# Altium project Biricutico.PrjPCB (part 1 of 2)
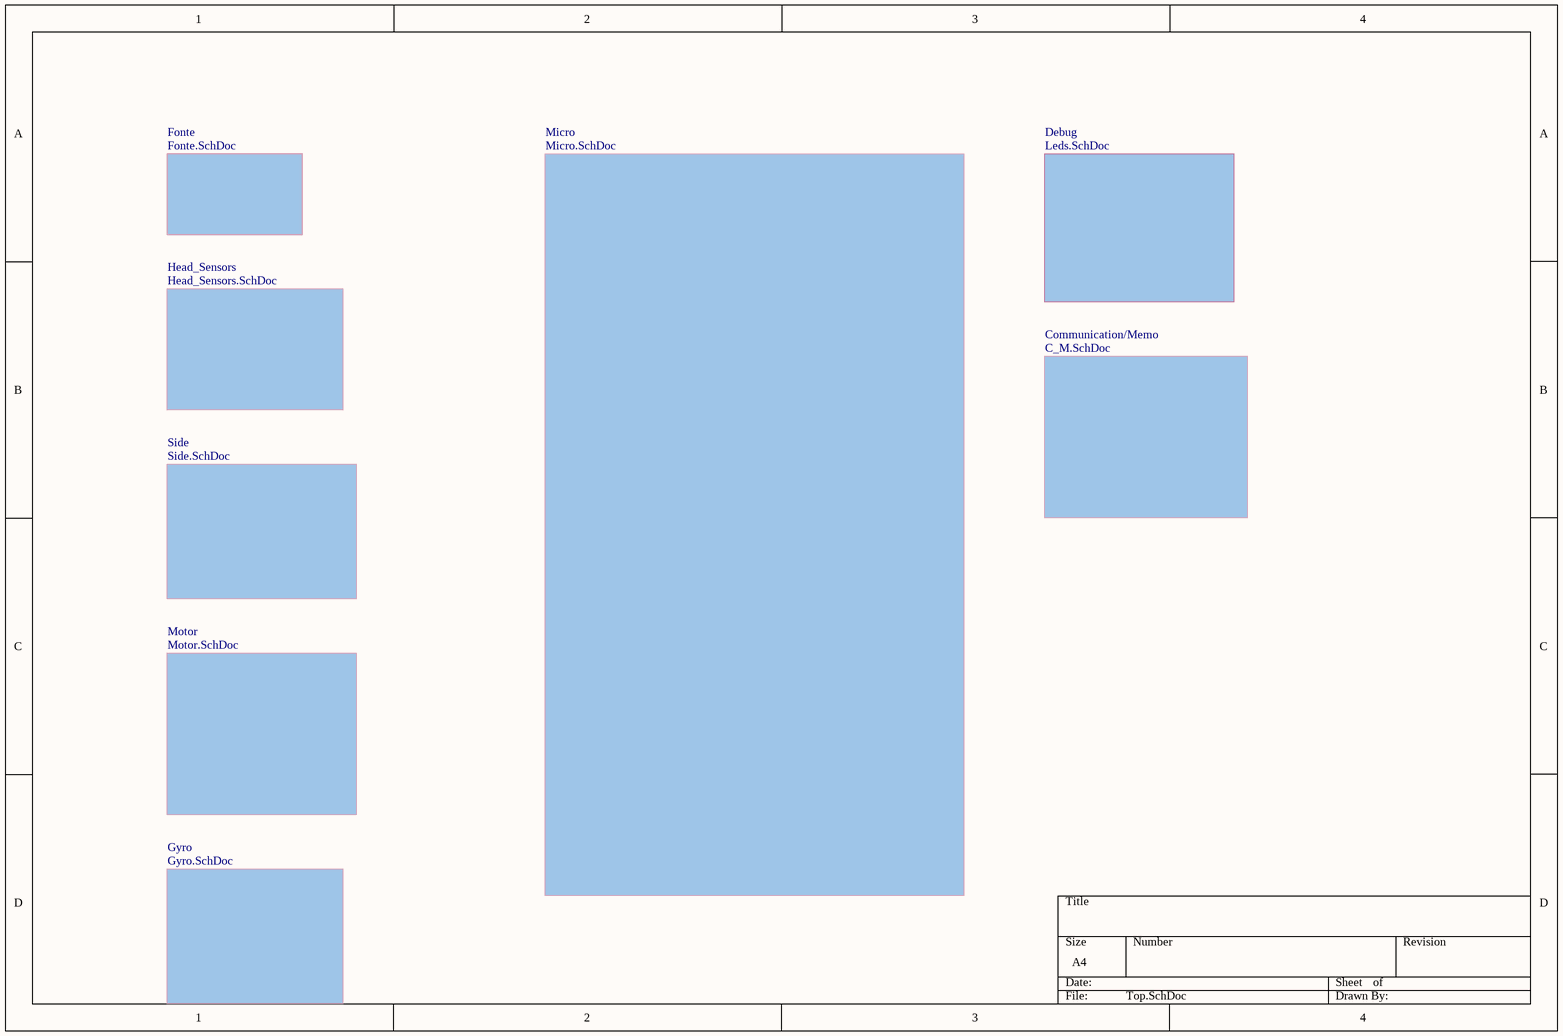
[diagram p0: Top.SchDoc]
9 sheets, 118 parts. Net scope: flat (ports and power ports of the same name join across sheets).
Board file: Biricutico.PcbDoc
Sheets:
  Top.SchDoc
    Fonte = Fonte.SchDoc
    Head_Sensors = Head_Sensors.SchDoc
    Gyro = Gyro.SchDoc
    Motor = Motor.SchDoc
    Communication/Memo = C_M.SchDoc
    Micro = Micro.SchDoc
    Side = Side.SchDoc
    Debug = Leds.SchDoc

## Sheet Top.SchDoc
size A4

### Sub-sheets
Communication/Memo = C_M.SchDoc: no entries
Debug = Leds.SchDoc: no entries
Fonte = Fonte.SchDoc: no entries
Gyro = Gyro.SchDoc: no entries
Head_Sensors = Head_Sensors.SchDoc: no entries
Micro = Micro.SchDoc: no entries
Motor = Motor.SchDoc: no entries
Side = Side.SchDoc: no entries

## Sheet Fonte.SchDoc
size A4
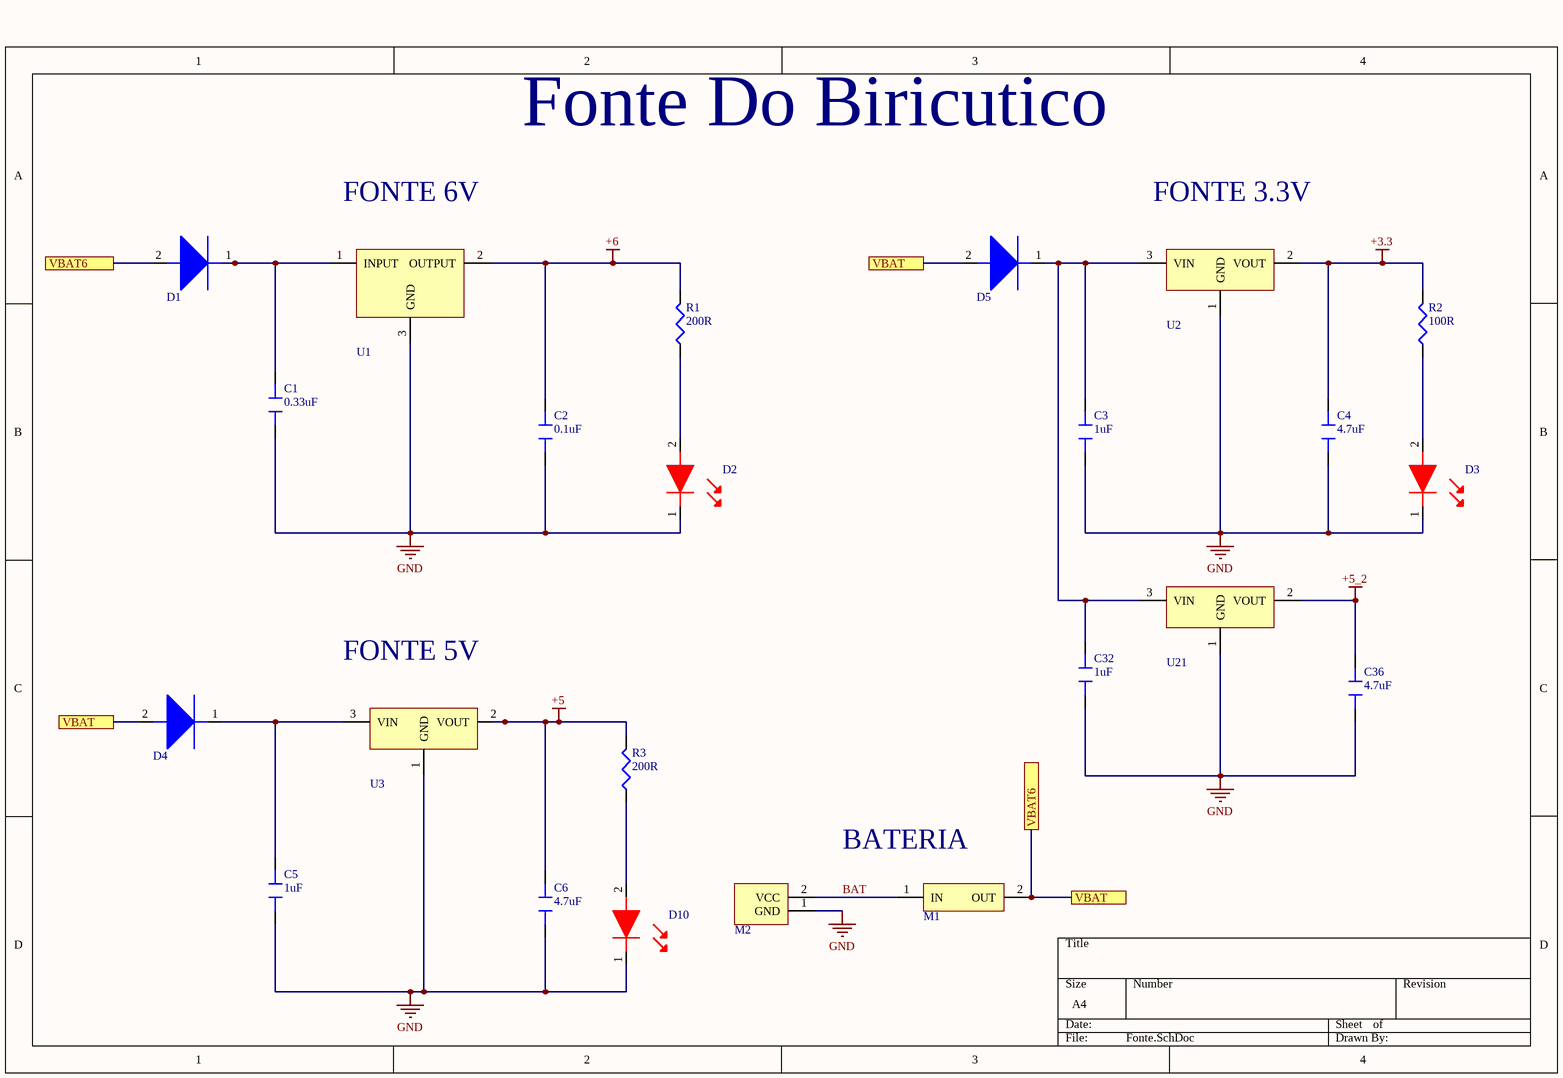
[diagram p1: Fonte.SchDoc]

### Parts
C1  0.33uF  [CAPACITOR 0805]
C2  0.1uF  [CAPACITOR 0805]
C3  1uF  [CAPACITOR 0805]
C4  4.7uF  [CAPACITOR 0805]
C5  1uF  [CAPACITOR 0805]
C6  4.7uF  [CAPACITOR 0805]
C32  1uF  [CAPACITOR 0805]
C36  4.7uF  [CAPACITOR 0805]
D1  Schottky Diode  [SODFL3516X85N]  (value not drawn)
D2  Standard LEDs - SMD  [Standard LEDs - SMD]  (value not drawn)
D3  Standard LEDs - SMD  [Standard LEDs - SMD]  (value not drawn)
D4  Schottky Diode  [SODFL3516X85N]  (value not drawn)
D5  Schottky Diode  [SODFL3516X85N]  (value not drawn)
D10  Standard LEDs - SMD  [Standard LEDs - SMD]  (value not drawn)
M1  Slide Switches  [Power_Switch]  (value not drawn)
M2  Headers (1x2)  [BATT]  (value not drawn)
R1  200R  [6-0805_M]
R2  100R  [0603]
R3  200R  [6-0805_M]
U1  Voltage Regulators 6V  [Voltage Regulators 6V]  (value not drawn)
U2  Voltage Regulators 3.3V  [SOT230P700X180-4N]  (value not drawn)
U3  Voltage Regulators 5V  [SOT230P700X180-4N]  (value not drawn)
U21  Voltage Regulators 5V  [SOT230P700X180-4N]  (value not drawn)

### Ports
VBAT, VBAT6

### Nets
+3.3: C4.2 R2.2 U2.2(VOUT)
+5: C6.2 R3.2 U3.2(VOUT)
+5_2: C36.2 U21.2(VOUT)
+6: C2.1 R1.2 U1.2(OUTPUT)
GND: C1.1 C2.2 C3.1 C4.1 C5.1 C6.1 C32.1 C36.1 D2.1 D3.1 D10.1 M2.1(GND) U1.3(GND) U2.1(GND) U3.1(GND) U21.1(GND)
BAT: M1.1(IN) M2.2(VCC)
VBAT: D1.2 D4.2 D5.2 M1.2(OUT) ; port VBAT, port VBAT6
NetC1_2: C1.2 D1.1 U1.1(INPUT)
NetC3_2: C3.2 C32.2 D5.1 U2.3(VIN) U21.3(VIN)
NetC5_2: C5.2 D4.1 U3.3(VIN)
NetD2_2: D2.2 R1.1
NetD3_2: D3.2 R2.1
NetD10_2: D10.2 R3.1

### Notes on the sheet
- Fonte Do Biricutico
- FONTE 6V
- FONTE 3.3V
- FONTE 5V
- (near M1) BATERIA

### Library data of the parts
C1 = Capacitor 0.33uF 0805: Multilayer Ceramic Capacitors MLCC - SMD/SMT 0805 0.33uF 16volts X7R 5%; Manufacturer: Vishay Vitramon; Manufacturer Part Number: VJ0805Y334JXJRW1BC; Dielectric Material: Tantalum; Capacitance: 330nF; Voltage Rating (DC): 16V; Supplier 1: Mouser; Stock 1: 9308; Pricing 1: 1=0.52, 10=0.52, 50=0.424, 100=0.308, 1000=0.135, 10000=0.075 (USD); Mount: Surface Mount; Case/Package: 0805; Weight: 0.000194oz; Case Code (Imperial): 0805; Case Code (Metric): 2012; Min Operating Temperature: -55°C; Max Operating Temperature: 125°C; Tolerance: 5%; Packaging: Tape and Reel; Package Quantity: 10000; Dielectric: X7R; Termination: SMD/SMT; Length: 2mm; Height: 1.45mm; Width: 1.25mm; Depth: 1.25mm; Lead Free: Lead Free; ComponentLink1URL: http://www.mouser.com/ds/2/427/vjw1bcbascomseries-223529.pdf?src-supplier=Mouser; ComponentLink1Description: http://www.mouser.com/ds/2/427/vjw1bcbascomseries-223529.pdf?src-supplier=Mouser; ComponentLink2URL: http://www.vishay.com/docs/28548/vjw1bcbascomseries.pdf?src-supplier=Avnet; ComponentLink2Description: http://www.vishay.com/docs/28548/vjw1bcbascomseries.pdf?src-supplier=Avnet; Supplier Part Number 1: 77-VJ0805Y334JXJRBC; Category: Multilayer Ceramic Capacitors MLCC - SMD/SMT
C2 = Capacitor  0.1uF 0805: Multilayer Ceramic Capacitors MLCC - SMD/SMT .1uF 50volts 10%; Manufacturer: Vishay Vitramon; Manufacturer Part Number: VJ0805Y104KXAAT; Capacitance: 100nF; Voltage Rating: 50V; Dielectric: X7R; Supplier 1: Mouser; Stock 1: 207342; Pricing 1: 1=0.2, 10=0.2, 50=0.162, 100=0.108, 500=0.095, 1000=0.084, 3000=0.072, 6000=0.069, 9000=0.065, 10000=0.065 (USD); Mount: Surface Mount; Case/Package: 0805; Weight: 0.000194oz; Case Code (Metric): 2012; Case Code (Imperial): 0805; Min Operating Temperature: -55°C; Max Operating Temperature: 125°C; Tolerance: 10%; Package Quantity: 1; Packaging: Tape and Reel; Voltage Rating (DC): 50V; Termination: SMD/SMT; Voltage: 50V; Length: 2mm; Height: 1.45mm; Width: 0.049inch; Thickness: 0.057inch; Depth: 1.25mm; Radiation Hardening: No; REACH SVHC: Unknown; Lead Free: Lead Free; ComponentLink1URL: http://www.mouser.com/ds/2/427/vjcommercialseries-222796.pdf?src-supplier=Mouser; ComponentLink1Description: http://www.mouser.com/ds/2/427/vjcommercialseries-222796.pdf?src-supplier=Mouser; ComponentLink2URL: http://www.vishay.com/docs/45199/vjcommercialseries.pdf?src-supplier=Digi-Key; ComponentLink2Description: http://www.vishay.com/docs/45199/vjcommercialseries.pdf?src-supplier=Digi-Key; ComponentLink3URL: http://www.vishay.com/docs/45199/vjcommercialseries.pdf?src-supplier=Future+Electronics; ComponentLink3Description: http://www.vishay.com/docs/45199/vjcommercialseries.pdf?src-supplier=Future+Electronics; Supplier Part Number 1: 77-VJ0805Y104KXAAT; Category: Multilayer Ceramic Capacitors MLCC - SMD/SMT
C3 C5 C32 = Capacitor 1uF 0805: Cap Ceramic 1uF 25V X7R 10% SMD 0805 125C Blister T/R; Manufacturer: Vishay; Manufacturer Part Number: VJ0805Y105KXXTW1BC; Dielectric Material: Tantalum; Supplier 1: Mouser; Stock 1: 40011; Pricing 1: 1=0.11, 10=0.11, 50=0.11, 100=0.055, 1000=0.038, 10000=0.038 (USD); Mount: Surface Mount; Case/Package: 0805; Min Operating Temperature: -55°C; Max Operating Temperature: 125°C; Capacitance: 1uF; Tolerance: 10%; Dielectric: X7R; Termination: Wraparound; Packaging: Tape and Reel; Voltage Rating (DC): 25V; Length: 2mm; Height: 1.25mm; Depth: 1.25mm; Radiation Hardening: No; Lead Free: Lead Free; ComponentLink1URL: http://www.vishay.com/docs/28548/vjw1bcbascomseries.pdf?src-supplier=Avnet+Europe; ComponentLink1Description: http://www.vishay.com/docs/28548/vjw1bcbascomseries.pdf?src-supplier=Avnet+Europe; Supplier Part Number 1: 77-VJ805Y105KXXTW1BC; Category: Multilayer Ceramic Capacitors MLCC - SMD/SMT
C4 C6 C36 = Capacitor 4.7uF 0805: MURATA - GRM21BR61H475KE51L - CAP, 4.7µF, 50V, 10%, X5R, 0805; Material: Ceramic; Supplier 1: Mouser; Manufacturer: Murata; Manufacturer Part Number: GRM21BR61H475KE51L; Stock 1: 243744; Pricing 1: 1=0.37, 10=0.256, 50=0.256, 100=0.153, 500=0.115, 1000=0.097, 3000=0.08, 6000=0.075, 9000=0.071, 10000=0.071 (USD); Mount: Surface Mount; Case/Package: 0805; Case Code (Metric): 2012; Case Code (Imperial): 0805; Min Operating Temperature: -55°C; Max Operating Temperature: 85°C; Capacitance: 4.7uF; Tolerance: 10%; Packaging: Tape and Reel; Dielectric: X5R; Voltage Rating: 50V; Voltage Rating (DC): 50V; Length: 2mm; Height: 1.25mm; Width: 0.049inch; Thickness: 0.055inch; Depth: 1.25mm; REACH SVHC: No SVHC; Lead Free: Lead Free; ComponentLink1URL: http://components.arrow.com/part/dataview/61084395S454511N2606?src-supplier=Arrow; ComponentLink1Description: http://components.arrow.com/part/dataview/61084395S454511N2606?src-supplier=Arrow; ComponentLink2URL: http://components.arrow.com/part/dataview/0323_07281654?src-supplier=Arrow+Europe; ComponentLink2Description: http://components.arrow.com/part/dataview/0323_07281654?src-supplier=Arrow+Europe; ComponentLink3URL: https://search.murata.co.jp/Ceramy/image/img/A01X/G101/ENG/GRM21BR61H475KE51-01.pdf?src-supplier=Digi-Key; ComponentLink3Description: https://search.murata.co.jp/Ceramy/image/img/A01X/G101/ENG/GRM21BR61H475KE51-01.pdf?src-supplier=Digi-Key; ComponentLink4URL: http://search.murata.co.jp/Ceramy/image/img/A01X/G101/ENG/GRM21BR61H475KE51-01.pdf?src-supplier=Digi-Key; ComponentLink4Description: http://search.murata.co.jp/Ceramy/image/img/A01X/G101/ENG/GRM21BR61H475KE51-01.pdf?src-supplier=Digi-Key; ComponentLink5URL: http://www.farnell.com/datasheets/2079186.pdf?src-supplier=Farnell; ComponentLink5Description: http://www.farnell.com/datasheets/2079186.pdf?src-supplier=Farnell; ComponentLink6URL: http://www.farnell.com/datasheets/2079186.pdf?src-supplier=Element14; ComponentLink6Description: http://www.farnell.com/datasheets/2079186.pdf?src-supplier=Element14; ComponentLink7URL: http://www.farnell.com/datasheets/2079186.pdf?src-supplier=Newark; ComponentLink7Description: http://www.farnell.com/datasheets/2079186.pdf?src-supplier=Newark; Supplier Part Number 1: 81-GRM21BR61H475KE1L; Category: Multilayer Ceramic Capacitors MLCC - SMD/SMT
D1 D4 D5 = Schottky Diode: DIODE SCHOTTKY 40V 3A MINI2; Manufacturer: Panasonic; Manufacturer Part Number: DB2W40300L; Max Surge Current: 30A; Recovery Time: 15ns; Peak Reverse Current: 250uA; Element Configuration: Single; Supplier 1: Mouser; Stock 1: 145800; Pricing 1: 1=0.6, 10=0.421, 50=0.421, 100=0.277, 500=0.164, 1000=0.126, 3000=0.104, 9000=0.095, 10000=0.095, 24000=0.089, 45000=0.08 (USD); Mount: Surface Mount; Number of Pins: 2; Min Operating Temperature: -55°C; Max Operating Temperature: 150°C; Packaging: Tape and Reel; Package Quantity: 3000; Forward Current: 3A; Max Reverse Leakage Current: 250uA; Average Rectified Current: 3A; Reverse Recovery Time: 15ns; Max Repetitive Reverse Voltage (Vrrm): 40V; Max Forward Surge Current (Ifsm): 30A; Max Reverse Voltage (DC): 40V; Length: 2.6mm; Height: 0.8mm; Width: 1.6mm; Lead Free: Lead Free; ComponentLink1URL: http://www.mouser.com/ds/2/315/DB2W403_BED-276390.pdf?src-supplier=Mouser; ComponentLink1Description: http://www.mouser.com/ds/2/315/DB2W403_BED-276390.pdf?src-supplier=Mouser; Supplier Part Number 1: 667-DB2W40300L; Category: Schottky Diodes & Rectifiers
D2 D3 D10 = Standard LEDs - SMD: WURTH ELEKTRONIK - 150060RS75000 - LED, 0603, RED, 250MCD, 625NM; Manufacturer: Wurth Electronics; Viewing Angle: 140°; Lens Style: Clear,Rectangular; Forward Current: 30mA; Forward Voltage: 2V; Test Current: 20mA; Supplier 1: Mouser; Manufacturer Part Number: 150060RS75000; Stock 1: 77279; Pricing 1: 1=0.14, 10=0.138, 50=0.129, 100=0.11, 1000=0.095, 10000=0.095 (USD); Mount: Surface Mount; Case/Package: 0603; Color: Red; Case Code (Metric): 1608; Case Code (Imperial): 0603; Min Operating Temperature: -40°C; Max Operating Temperature: 85°C; Package Quantity: 1; Packaging: Cut Tape; Luminous Intensity: 250mcd; Wavelength: 625nm; Dominant Wavelength: 625nm; Length: 1.6mm; Height: 0.7mm; Width: 0.8mm; REACH SVHC: Unknown; ComponentLink1URL: https://katalog.we-online.de/led/datasheet/150060RS75000.pdf?src-supplier=Digi-Key; ComponentLink1Description: https://katalog.we-online.de/led/datasheet/150060RS75000.pdf?src-supplier=Digi-Key; ComponentLink2URL: http://www.produktinfo.conrad.com/datenblaetter/750000-774999/759428-da-01-en-CHIPLED_0603_W_KL_ROT_150060RS75000.pdf?src-supplier=Conrad; ComponentLink2Description: http://www.produktinfo.conrad.com/datenblaetter/750000-774999/759428-da-01-en-CHIPLED_0603_W_KL_ROT_150060RS75000.pdf?src-supplier=Conrad; Supplier Part Number 1: 710-150060RS75000; Category: Standard LEDs - SMD
M1 = Slide Switches: 46202LRX-; Manufacturer: Switchcraft; Actuator Material: Thermoplastic; Contact Current Rating: 3A; Voltage Rating (AC): 125V; Throw Configuration: SPST; Contact Style: Non-Shorting; Switch Travel: 4.78mm; Switch Function: On-Off; Actuator Type: Standard; Actuator Length: 8.74mm; Supplier 1: Mouser; Manufacturer Part Number: 46202LRX; Stock 1: 374; Pricing 1: 1=1.31, 10=1.27, 25=1.15, 50=1.02, 100=0.897, 1000=0.897, 10000=0.897 (USD); Mount: Panel; Contact Plating: Silver; Contact Material: Copper Alloy,Brass; Housing Material: Steel; Min Operating Temperature: -20°C; Max Operating Temperature: 70°C; Package Quantity: 1; Max Current Rating: 3A; Max Voltage Rating (AC): 125V; Voltage Rating (DC): 125V; Packaging: Bulk; Current Rating: 3A; Max Voltage Rating (DC): 125V; Termination: Solder; Voltage Rating: 125V; Orientation: Vertical; Length: 35.05mm; Width: 13.5mm; Depth: 13.46mm; REACH SVHC: Unknown; Lead Free: Lead Free; ComponentLink1URL: https://www.alliedelec.com/m/d/b871a11ddd3a58540a403f8c1668b2ef.pdf?src-supplier=Allied+Electronics; ComponentLink1Description: https://www.alliedelec.com/m/d/b871a11ddd3a58540a403f8c1668b2ef.pdf?src-supplier=Allied+Electronics; ComponentLink2URL: http://uk.rs-online.com/webdocs/141a/0900766b8141acc7.pdf?src-supplier=RSComponents; ComponentLink2Description: http://uk.rs-online.com/webdocs/141a/0900766b8141acc7.pdf?src-supplier=RSComponents; ComponentLink3URL: http://www.switchcraft.com/Drawings/46200LRX_SERIES_CD.pdf?src-supplier=Digi-Key; ComponentLink3Description: http://www.switchcraft.com/Drawings/46200LRX_SERIES_CD.pdf?src-supplier=Digi-Key; ComponentLink4URL: http://www.switchcraft.com/Drawings/46200LRX%20SERIES_CD.pdf?src-supplier=Mouser; ComponentLink4Description: http://www.switchcraft.com/Drawings/46200LRX%20SERIES_CD.pdf?src-supplier=Mouser; ComponentLink5URL: http://www.farnell.com/datasheets/814601.pdf?src-supplier=Farnell; ComponentLink5Description: http://www.farnell.com/datasheets/814601.pdf?src-supplier=Farnell; ComponentLink6URL: http://components.arrow.com/part/dataview/42506918S9181833N6102?src-supplier=Arrow; ComponentLink6Description: http://components.arrow.com/part/dataview/42506918S9181833N6102?src-supplier=Arrow; ComponentLink7URL: http://www.farnell.com/datasheets/814601.pdf?src-supplier=Element14; ComponentLink7Description: http://www.farnell.com/datasheets/814601.pdf?src-supplier=Element14; Supplier Part Number 1: 502-46202LRX; Category: Slide Switches
M2 = Headers (1x2): Headers & Wire Housings HDR STRT SINGLE 2P; Manufacturer: Molex; Manufacturer Part Number: 90136-1202; Number of Poles: 2; Current Rating: 3A; Voltage Rating (AC): 350V; Contact Resistance: 20mR; Max Voltage Rating (DC): 350.35kV; Insulation Resistance: 5GR; Gender: Male; Pitch: 2.54mm; Glow Wire Compliant: Non-compliant; Supplier 1: Mouser; Stock 1: 2623; Pricing 1: 1=1.07, 10=0.89, 50=0.89, 100=0.776, 500=0.677, 1000=0.613, 2500=0.536, 10000=0.492, 25000=0.479, 50000=0.467 (USD); Mount: Through Hole; Contact Plating: Gold; Contact Material: Brass,Copper Alloy; Color: Black; Housing Color: Black; Housing Material: Polyester; Min Operating Temperature: -55°C; Max Operating Temperature: 125°C; Number of Rows: 1; Packaging: Tray; Package Quantity: 3040; Voltage Rating: 350V; Number of Positions: 2; Termination: Through Hole; Number of Circuits: 2; Number of Contacts: 2; Working Voltage: 350V; Orientation: Vertical; Voltage Rating (DC): 350V; Lead Pitch: 2.54mm; Radiation Hardening: No; REACH SVHC: Unknown; Lead Free: Lead Free; Flammability Rating: UL94 V-0; ComponentLink1URL: http://www.molex.com/webdocs/datasheets/pdf/en-us/0901361202_PCB_HEADERS.pdf?src-supplier=Avnet+Europe; ComponentLink1Description: http://www.molex.com/webdocs/datasheets/pdf/en-us/0901361202_PCB_HEADERS.pdf?src-supplier=Avnet+Europe; ComponentLink2URL: http://www.mouser.com/ds/2/276/0901361202_PCB_HEADERS-176812.pdf?src-supplier=Mouser; ComponentLink2Description: http://www.mouser.com/ds/2/276/0901361202_PCB_HEADERS-176812.pdf?src-supplier=Mouser; ComponentLink3URL: http://www.molex.com/webdocs/datasheets/pdf/en-us/0901361202_PCB_HEADERS.pdf?src-supplier=Avnet; ComponentLink3Description: http://www.molex.com/webdocs/datasheets/pdf/en-us/0901361202_PCB_HEADERS.pdf?src-supplier=Avnet; ComponentLink4URL: https://www.distrelec.biz/Web/Downloads/_d/wg/cgrid_III_90136_eng_dwg.pdf?mime=application%2Fpdf&src-supplier=Distrelec; ComponentLink4Description: https://www.distrelec.biz/Web/Downloads/_d/wg/cgrid_III_90136_eng_dwg.pdf?mime=application%2Fpdf&src-supplier=Distrelec; ComponentLink5URL: http://uk.rs-online.com/webdocs/1362/0900766b81362c51.pdf?src-supplier=RSComponents; ComponentLink5Description: http://uk.rs-online.com/webdocs/1362/0900766b81362c51.pdf?src-supplier=RSComponents; ComponentLink6URL: http://www.onlinecomponents.com/productFiles/mf-MOL/248400901361202_pcb_headers.pdf?src-supplier=Onlinecomponents.com; ComponentLink6Description: http://www.onlinecomponents.com/productFiles/mf-MOL/248400901361202_pcb_headers.pdf?src-supplier=Onlinecomponents.com; Supplier Part Number 1: 538-90136-1202; Category: Headers & Wire Housings
R1 R3 = Resistor 200 0805: RES SMD 200 OHM 1% 1/8W 0805; Manufacturer: Vishay; Manufacturer Part Number: CRCW0805200RFKEA; Power Rating: 125mW; Voltage Rating: 150V; Temperature Coefficient: 100ppm/°C; Supplier 1: Mouser; Stock 1: 44278; Pricing 1: 1=0.1, 10=0.066, 50=0.066, 100=0.047, 1000=0.027, 10000=0.015 (USD); Mount: Surface Mount; Case/Package: 0805; Number of Pins: 2; Weight: 0.000194oz; Case Code (Metric): 2012; Case Code (Imperial): 0805; Contact Plating: Tin; Min Operating Temperature: -55°C; Max Operating Temperature: 155°C; Resistance: 200R; Tolerance: 1%; Packaging: Tape and Reel; Package Quantity: 10; Composition: Thick Film; Number of Terminations: 2; Termination: SMD/SMT; Military Standard: Not; Max Power Dissipation: 125mW; Voltage Rating (DC): 150V; Working Voltage: 150V; Features: Automotive AEC-Q200; Length: 2mm; Height: 0.45mm; Width: 0.049inch; Depth: 1.25mm; Radiation Hardening: No; REACH SVHC: Unknown; Lead Free: Lead Free; ComponentLink1URL: http://www.vishay.com/docs/20035/dcrcwe3.pdf?src-supplier=Digi-Key; ComponentLink1Description: http://www.vishay.com/docs/20035/dcrcwe3.pdf?src-supplier=Digi-Key; ComponentLink2URL: http://www.vishay.com/docs/20035/dcrcwe3.pdf?src-supplier=Avnet+Europe; ComponentLink2Description: http://www.vishay.com/docs/20035/dcrcwe3.pdf?src-supplier=Avnet+Europe; ComponentLink3URL: http://www.farnell.com/datasheets/2310790.pdf?src-supplier=Element14; ComponentLink3Description: http://www.farnell.com/datasheets/2310790.pdf?src-supplier=Element14; ComponentLink4URL: http://www.alliedelec.com/m/d/0c934d6939ccefa68dbe0b96d821c8cf.pdf?src-supplier=Allied+Electronics; ComponentLink4Description: http://www.alliedelec.com/m/d/0c934d6939ccefa68dbe0b96d821c8cf.pdf?src-supplier=Allied+Electronics; ComponentLink5URL: http://www.mouser.com/ds/2/427/dcrcwe3-109170.pdf?src-supplier=Mouser; ComponentLink5Description: http://www.mouser.com/ds/2/427/dcrcwe3-109170.pdf?src-supplier=Mouser; ComponentLink6URL: https://www.distrelec.biz/Web/Downloads/a_/en/flD-CRCW-e3_data_en.pdf?mime=application%2Fpdf&src-supplier=Distrelec; ComponentLink6Description: https://www.distrelec.biz/Web/Downloads/a_/en/flD-CRCW-e3_data_en.pdf?mime=application%2Fpdf&src-supplier=Distrelec; ComponentLink7URL: http://uk.rs-online.com/webdocs/13ec/0900766b813ecbf4.pdf?src-supplier=RSComponents; ComponentLink7Description: http://uk.rs-online.com/webdocs/13ec/0900766b813ecbf4.pdf?src-supplier=RSComponents; ComponentLink8URL: http://www.vishay.com/docs/20035/dcrcwe3.pdf?src-supplier=Avnet; ComponentLink8Description: http://www.vishay.com/docs/20035/dcrcwe3.pdf?src-supplier=Avnet; ComponentLink9URL: http://www.vishay.com/docs/20035/dcrcwe3.pdf?src-supplier=Future+Electronics; ComponentLink9Description: http://www.vishay.com/docs/20035/dcrcwe3.pdf?src-supplier=Future+Electronics; Supplier Part Number 1: 71-CRCW0805-200-E3; Category: Thick Film Resistors - SMD
R2 = Resistor 100 0603: RES SMD 100 OHM 1% 1/10W 0603; Manufacturer: Vishay Intertechnology; Manufacturer Part Number: CRCW0603100RFKEA; Power Rating: 100mW; Voltage Rating (DC): 75V; Temperature Coefficient: 100ppm/°C; Supplier 1: Mouser; Stock 1: 221485; Pricing 1: 1=0.1, 10=0.037, 50=0.037, 100=0.026, 1000=0.006, 10000=0.005 (USD); Case/Package: 0603; Number of Pins: 2; Packaging: Cut Tape; Resistance: 100R; Tolerance: 1%; Length: 1.55mm; Height: 450um; Width: 850um; REACH SVHC: No SVHC; Lead Free: Lead Free; Supplier Part Number 1: 71-CRCW0603-100-E3; Category: Thick Film Resistors - SMD
U1 = Voltage Regulators 6V: IC REG LINEAR 6V 1.5A D2PAK; Manufacturer: STMicroelectronics; Manufacturer Part Number: L7806ABD2T-TR; Dropout Voltage: 2V; Number of Outputs: 1; Max Input Voltage: 35V; Min Input Voltage: 8V; Polarity: Positive; Quiescent Current: 6mA; Output Voltage Accuracy: 2%; Power Supply Rejection Ratio (PSRR): 65dB; Output Type: Fixed; Supplier 1: Mouser; Stock 1: 2009; Pricing 1: 1=0.78, 10=0.651, 50=0.651, 100=0.42, 1000=0.336, 2000=0.284, 10000=0.274, 25000=0.263, 50000=0.259, 100000=0.253 (USD); Mount: Surface Mount; Case/Package: TO-263; Number of Pins: 3; Min Operating Temperature: -40°C; Max Operating Temperature: 125°C; Output Current: 1.5A; Package Quantity: 1; Packaging: Tape and Reel; Output Voltage: 6V; Max Output Current: 1.5A; Number of Regulators: 1; Min Output Voltage: 6V; Accuracy: 2%; Length: 10.4mm; Height: 4.6mm; Width: 9.35mm; Radiation Hardening: No; Lead Free: Lead Free; ComponentLink1URL: http://www.st.com/content/ccc/resource/technical/document/datasheet/41/4f/b3/b0/12/d4/47/88/CD00000444.pdf/files/CD00000444.pdf/jcr:content/translations/en.CD00000444.pdf?src-supplier=Digi-Key; ComponentLink1Description: http://www.st.com/content/ccc/resource/technical/document/datasheet/41/4f/b3/b0/12/d4/47/88/CD00000444.pdf/files/CD00000444.pdf/jcr:content/translations/en.CD00000444.pdf?src-supplier=Digi-Key; ComponentLink2URL: http://www.st.com/web/en/resource/technical/document/datasheet/CD00000444.pdf?src-supplier=Avnet+Europe; ComponentLink2Description: http://www.st.com/web/en/resource/technical/document/datasheet/CD00000444.pdf?src-supplier=Avnet+Europe; ComponentLink3URL: http://www.st.com/web/en/resource/technical/document/datasheet/CD00000444.pdf?src-supplier=Future+Electronics; ComponentLink3Description: http://www.st.com/web/en/resource/technical/document/datasheet/CD00000444.pdf?src-supplier=Future+Electronics; ComponentLink4URL: http://www.mouser.com/ds/2/389/l78-974043.pdf?src-supplier=Mouser; ComponentLink4Description: http://www.mouser.com/ds/2/389/l78-974043.pdf?src-supplier=Mouser; ComponentLink5URL: http://www.st.com/web/en/resource/technical/document/datasheet/CD00000444.pdf?src-supplier=Avnet; ComponentLink5Description: http://www.st.com/web/en/resource/technical/document/datasheet/CD00000444.pdf?src-supplier=Avnet; Supplier Part Number 1: 511-L7806ABD2T-TR; Category: Linear Voltage Regulators
U2 = Voltage Regulators 3.3V: IC REG LINEAR 3.3V 1.2A SOT223; Manufacturer: STMicroelectronics; Manufacturer Part Number: LDL1117S33R; Output Type: Fixed; Output Configuration: Positive; Number of Regulators: 1; Max Input Voltage: 18V; Dropout Voltage: 600mV; Quiescent Current: 500uA; Power Supply Rejection Ratio (PSRR): 65dB; Supplier 1: Mouser; Stock 1: 8562; Pricing 1: 1=0.43, 10=0.332, 50=0.332, 100=0.18, 1000=0.135, 2500=0.116, 10000=0.109, 25000=0.1, 50000=0.096, 100000=0.093 (USD); Mount: Surface Mount; Case/Package: TO-261-4; Min Operating Temperature: -40°C; Max Operating Temperature: 125°C; Packaging: Tape and Reel; Min Output Voltage: 3.3V; Output Current: 1.2A; ComponentLink1URL: http://www.farnell.com/datasheets/2259188.pdf?src-supplier=Farnell; ComponentLink1Description: http://www.farnell.com/datasheets/2259188.pdf?src-supplier=Farnell; ComponentLink2URL: http://www.st.com/content/ccc/resource/technical/document/datasheet/group3/0e/5a/00/ca/10/1a/4f/a5/DM00366442/files/DM00366442.pdf/jcr:content/translations/en.DM00366442.pdf?src-supplier=Digi-Key; ComponentLink2Description: http://www.st.com/content/ccc/resource/technical/document/datasheet/group3/0e/5a/00/ca/10/1a/4f/a5/DM00366442/files/DM00366442.pdf/jcr:content/translations/en.DM00366442.pdf?src-supplier=Digi-Key; ComponentLink3URL: http://www.farnell.com/datasheets/2259188.pdf?src-supplier=Newark; ComponentLink3Description: http://www.farnell.com/datasheets/2259188.pdf?src-supplier=Newark; ComponentLink4URL: http://www.farnell.com/datasheets/2259188.pdf?src-supplier=Element14; ComponentLink4Description: http://www.farnell.com/datasheets/2259188.pdf?src-supplier=Element14; Supplier Part Number 1: 511-LDL1117S33R; Category: Linear Voltage Regulators
U3 U21 = Voltage Regulators 5V: IC REG LINEAR 5V 1.2A SOT223; Manufacturer: STMicroelectronics; Manufacturer Part Number: LDL1117S50R; Output Type: Fixed; Output Configuration: Positive; Number of Regulators: 1; Max Input Voltage: 18V; Dropout Voltage: 600mV; Quiescent Current: 500uA; Power Supply Rejection Ratio (PSRR): 65dB; Supplier 1: Mouser; Stock 1: 9455; Pricing 1: 1=0.44, 10=0.332, 50=0.332, 100=0.18, 1000=0.135, 2500=0.116, 10000=0.109 (USD); Mount: Surface Mount; Case/Package: TO-261-4; Min Operating Temperature: -40°C; Max Operating Temperature: 125°C; Packaging: Tape and Reel; Min Output Voltage: 5V; Output Current: 1.2A; ComponentLink1URL: http://www.st.com/content/ccc/resource/technical/document/datasheet/group3/0e/5a/00/ca/10/1a/4f/a5/DM00366442/files/DM00366442.pdf/jcr:content/translations/en.DM00366442.pdf?src-supplier=Digi-Key; ComponentLink1Description: http://www.st.com/content/ccc/resource/technical/document/datasheet/group3/0e/5a/00/ca/10/1a/4f/a5/DM00366442/files/DM00366442.pdf/jcr:content/translations/en.DM00366442.pdf?src-supplier=Digi-Key; ComponentLink2URL: http://www.farnell.com/datasheets/2259188.pdf?src-supplier=Farnell; ComponentLink2Description: http://www.farnell.com/datasheets/2259188.pdf?src-supplier=Farnell; Supplier Part Number 1: 511-LDL1117S50R; Category: Linear Voltage Regulators

## Sheet Head_Sensors.SchDoc
size A4
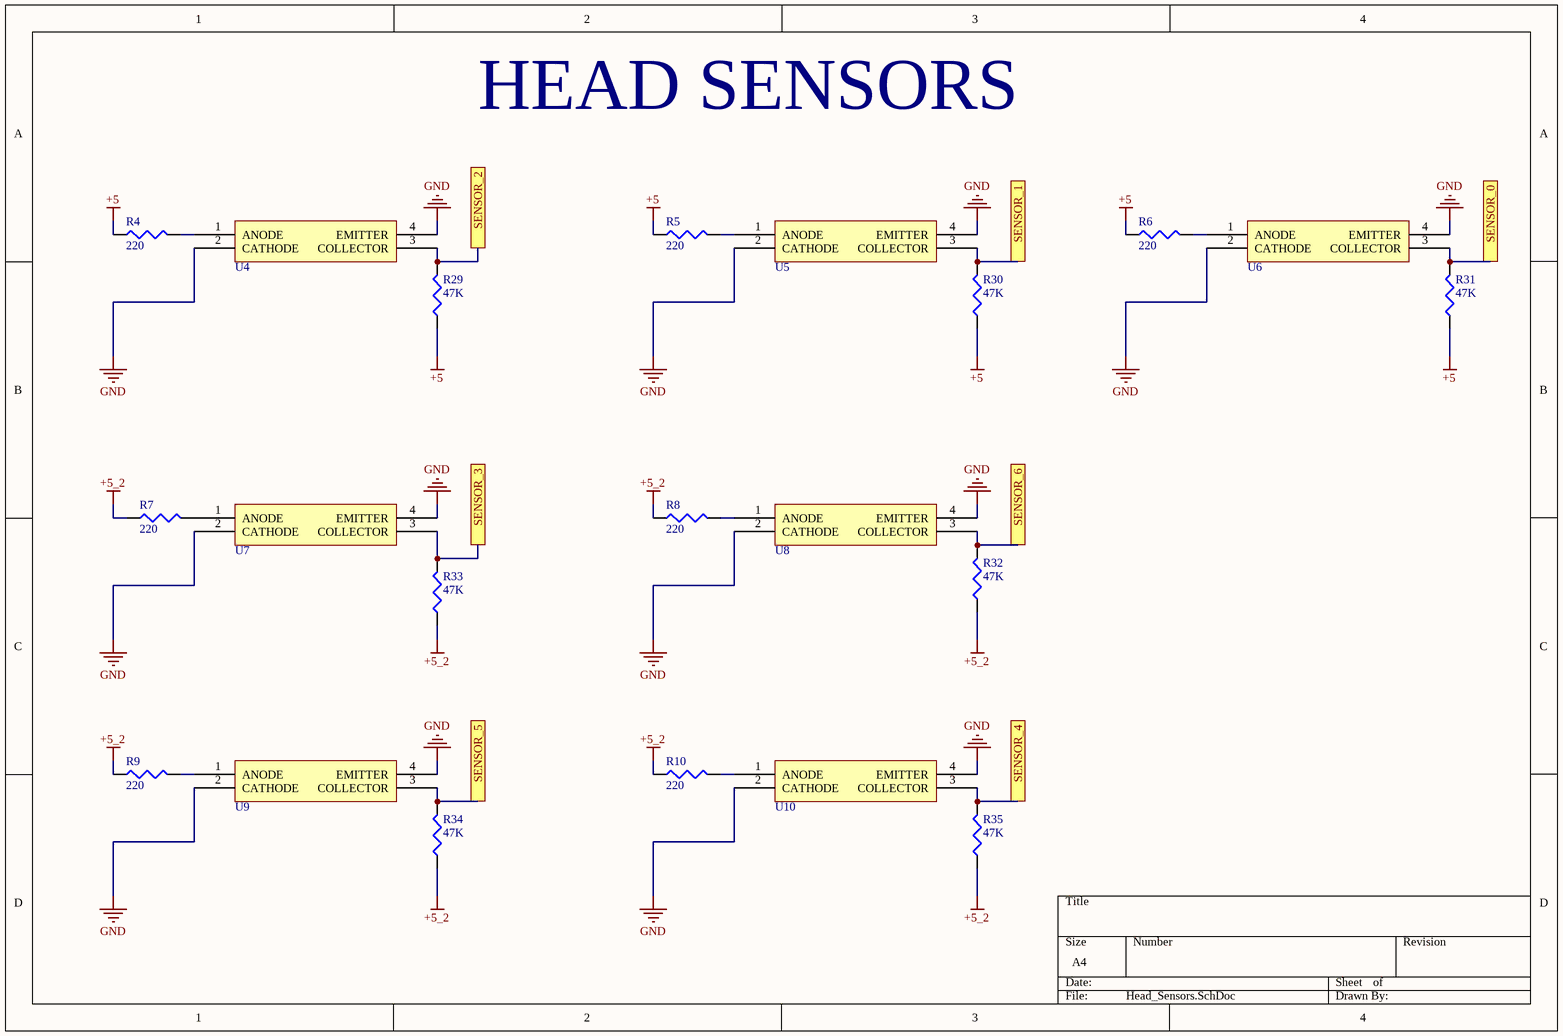
[diagram p2: Head_Sensors.SchDoc]

### Parts
R4  220  [6-0805_M]
R5  220  [6-0805_M]
R6  220  [6-0805_M]
R7  220  [6-0805_M]
R8  220  [6-0805_M]
R9  220  [6-0805_M]
R10  220  [6-0805_M]
R29  47K  [6-0805_M]
R30  47K  [6-0805_M]
R31  47K  [6-0805_M]
R32  47K  [6-0805_M]
R33  47K  [6-0805_M]
R34  47K  [6-0805_M]
R35  47K  [6-0805_M]
U4  Optical Switches  [QRE1113GR]  (value not drawn)
U5  Optical Switches  [QRE1113GR]  (value not drawn)
U6  Optical Switches  [QRE1113GR]  (value not drawn)
U7  Optical Switches  [QRE1113GR]  (value not drawn)
U8  Optical Switches  [QRE1113GR]  (value not drawn)
U9  Optical Switches  [QRE1113GR]  (value not drawn)
U10  Optical Switches  [QRE1113GR]  (value not drawn)

### Ports
SENSOR_0, SENSOR_1, SENSOR_2, SENSOR_3, SENSOR_4, SENSOR_5, SENSOR_6

### Nets
+5: R4.1 R5.1 R6.1 R29.1 R30.1 R31.1
+5_2: R7.1 R8.1 R9.1 R10.1 R32.1 R33.1 R34.1 R35.1
GND: U4.2(CATHODE) U4.4(EMITTER) U5.2(CATHODE) U5.4(EMITTER) U6.2(CATHODE) U6.4(EMITTER) U7.2(CATHODE) U7.4(EMITTER) U8.2(CATHODE) U8.4(EMITTER) U9.2(CATHODE) U9.4(EMITTER) U10.2(CATHODE) U10.4(EMITTER)
SENSOR_0: R31.2 U6.3(COLLECTOR) ; port SENSOR_0
SENSOR_1: R30.2 U5.3(COLLECTOR) ; port SENSOR_1
SENSOR_2: R29.2 U4.3(COLLECTOR) ; port SENSOR_2
SENSOR_3: R33.2 U7.3(COLLECTOR) ; port SENSOR_3
SENSOR_4: R35.2 U10.3(COLLECTOR) ; port SENSOR_4
SENSOR_5: R34.2 U9.3(COLLECTOR) ; port SENSOR_5
SENSOR_6: R32.2 U8.3(COLLECTOR) ; port SENSOR_6
NetR4_2: R4.2 U4.1(ANODE)
NetR5_2: R5.2 U5.1(ANODE)
NetR6_2: R6.2 U6.1(ANODE)
NetR7_2: R7.2 U7.1(ANODE)
NetR8_2: R8.2 U8.1(ANODE)
NetR9_2: R9.2 U9.1(ANODE)
NetR10_2: R10.2 U10.1(ANODE)

### Notes on the sheet
- HEAD SENSORS

### Library data of the parts
R4-R10 = Resistor 220 0805: RES SMD 220 OHM 1% 1/8W 0805; Manufacturer: Vishay Semiconductors; Manufacturer Part Number: CRCW0805220RFKEAC; Resistance: 220R; Power Rating: 125mW; Temperature Coefficient: 100ppm/°C; Supplier 1: Mouser; Stock 1: 36802; Pricing 1: 1=0.1, 10=0.052, 100=0.02, 500=0.012, 1000=0.006, 5000=0.005 (USD); Mount: Surface Mount; Case/Package: SMD/SMT; Contact Plating: Tin; Min Operating Temperature: -55°C; Max Operating Temperature: 155°C; Composition: Thick Film; Tolerance: 1%; Termination: Wraparound; Length: 2mm; Lead Free: Lead Free; Supplier Part Number 1: 71-CRCW0805220RFKEAC; Category: Thick Film Resistors - SMD
R29-R35 = Resistor 47K 0805: RES SMD 47K OHM 1% 1/8W 0805; Manufacturer: Vishay; Manufacturer Part Number: CRCW080547K0FKEA; Resistance: 47kR; Voltage Rating: 150V; Power Rating: 125mW; Temperature Coefficient: 100ppm/°C; Supplier 1: Mouser; Stock 1: 21962; Pricing 1: 1=0.1, 10=0.066, 50=0.066, 100=0.047, 1000=0.027, 5000=0.019, 10000=0.015, 25000=0.013, 50000=0.011, 100000=0.01 (USD); Case/Package: 0805; Weight: 0.000194oz; Case Code (Imperial): 0805; Case Code (Metric): 2012; Contact Plating: Tin; Min Operating Temperature: -55°C; Max Operating Temperature: 155°C; Tolerance: 1%; Packaging: Tape and Reel; Package Quantity: 10; Composition: Thick Film; Termination: SMD/SMT; Number of Terminations: 2; Military Standard: Not; Max Power Dissipation: 125mW; Voltage Rating (DC): 150V; Features: Automotive AEC-Q200; Working Voltage: 150V; Length: 2mm; Height: 0.45mm; Width: 1.25mm; Depth: 1.25mm; Radiation Hardening: No; REACH SVHC: Unknown; Lead Free: Lead Free; ComponentLink1URL: https://www.alliedelec.com/m/d/0c934d6939ccefa68dbe0b96d821c8cf.pdf?src-supplier=Allied+Electronics; ComponentLink1Description: https://www.alliedelec.com/m/d/0c934d6939ccefa68dbe0b96d821c8cf.pdf?src-supplier=Allied+Electronics; ComponentLink2URL: http://www.vishay.com/docs/20035/dcrcwe3.pdf?src-supplier=Digi-Key; ComponentLink2Description: http://www.vishay.com/docs/20035/dcrcwe3.pdf?src-supplier=Digi-Key; ComponentLink3URL: http://www.vishay.com/docs/20035/dcrcwe3.pdf?src-supplier=Future+Electronics; ComponentLink3Description: http://www.vishay.com/docs/20035/dcrcwe3.pdf?src-supplier=Future+Electronics; ComponentLink4URL: https://www.distrelec.biz/Web/Downloads/a_/en/flD-CRCW-e3_data_en.pdf?mime=application%2Fpdf&src-supplier=Distrelec; ComponentLink4Description: https://www.distrelec.biz/Web/Downloads/a_/en/flD-CRCW-e3_data_en.pdf?mime=application%2Fpdf&src-supplier=Distrelec; ComponentLink5URL: http://www.farnell.com/datasheets/2310790.pdf?src-supplier=Element14; ComponentLink5Description: http://www.farnell.com/datasheets/2310790.pdf?src-supplier=Element14; ComponentLink6URL: http://www.vishay.com/docs/20035/dcrcwe3.pdf?src-supplier=Avnet; ComponentLink6Description: http://www.vishay.com/docs/20035/dcrcwe3.pdf?src-supplier=Avnet; ComponentLink7URL: http://uk.rs-online.com/webdocs/0d98/0900766b80d98b26.pdf?src-supplier=RSComponents; ComponentLink7Description: http://uk.rs-online.com/webdocs/0d98/0900766b80d98b26.pdf?src-supplier=RSComponents; ComponentLink8URL: http://www.vishay.com/docs/20035/dcrcwe3.pdf?src-supplier=Avnet+Europe; ComponentLink8Description: http://www.vishay.com/docs/20035/dcrcwe3.pdf?src-supplier=Avnet+Europe; ComponentLink9URL: http://www.farnell.com/datasheets/2046716.pdf?src-supplier=Element14; ComponentLink9Description: http://www.farnell.com/datasheets/2046716.pdf?src-supplier=Element14; Supplier Part Number 1: 71-CRCW0805-47K-E3; Category: Thick Film Resistors - SMD
U4-U10 = Optical Switches: SENSOR OPTO TRANS REFL SMD PHOTO; Manufacturer: ON Semiconductor / Fairchild; Wavelength: 940nm; Forward Current: 50mA; Rise Time: 20us; Forward Voltage: 1.2V; Sensing Distance: 0.197inch; Collector Emitter Voltage (VCEO): 30V; Max Collector Current: 20mA; Number of Channels: 1; Reverse Breakdown Voltage: 5V; Power Dissipation: 75mW; Operating Supply Voltage: 1.7V; Output Type: Phototransistor; Supplier 1: Mouser; Manufacturer Part Number: QRE1113GR; Stock 1: 10425; Pricing 1: 1=0.86, 10=0.713, 50=0.713, 100=0.46, 1000=0.368, 10000=0.3 (USD); Mount: Surface Mount; Case/Package: SMD/SMT; Number of Pins: 4; Weight: 0.078g; Contact Plating: Tin,Matte; Min Operating Temperature: -40°C; Max Operating Temperature: 85°C; Packaging: Tape and Reel; Fall Time: 20us; Package Quantity: 1000; Reverse Voltage (DC): 5V; Collector Emitter Breakdown Voltage: 30V; Response Time: 20us; Max Breakdown Voltage: 30V; Number of Elements: 1; Input Current: 50mA; Max Power Dissipation: 75mW; Length: 3.6mm; Height: 1.7mm; Width: 2.9mm; Radiation Hardening: No; REACH SVHC: No SVHC; Lead Free: Lead Free; ComponentLink1URL: http://www.farnell.com/datasheets/1725706.pdf?src-supplier=Element14; ComponentLink1Description: http://www.farnell.com/datasheets/1725706.pdf?src-supplier=Element14; ComponentLink2URL: https://www.verical.com/server-webapp/html/getDatasheet?partID=146181&src-supplier=Verical; ComponentLink2Description: https://www.verical.com/server-webapp/html/getDatasheet?partID=146181&src-supplier=Verical; ComponentLink3URL: https://www.fairchildsemi.com/datasheets/QR/QRE1113.pdf?src-supplier=Avnet; ComponentLink3Description: https://www.fairchildsemi.com/datasheets/QR/QRE1113.pdf?src-supplier=Avnet; ComponentLink4URL: http://www.fairchildsemi.com/ds/QR/QRE1113.pdf?src-supplier=Avnet+Europe; ComponentLink4Description: http://www.fairchildsemi.com/ds/QR/QRE1113.pdf?src-supplier=Avnet+Europe; ComponentLink5URL: https://www.fairchildsemi.com/datasheets/QR/QRE1113.pdf?src-supplier=Digi-Key; ComponentLink5Description: https://www.fairchildsemi.com/datasheets/QR/QRE1113.pdf?src-supplier=Digi-Key; Supplier Part Number 1: 512-QRE1113GR; Category: Optical Switches, Reflective, Phototransistor Output

## Sheet Gyro.SchDoc
size A4
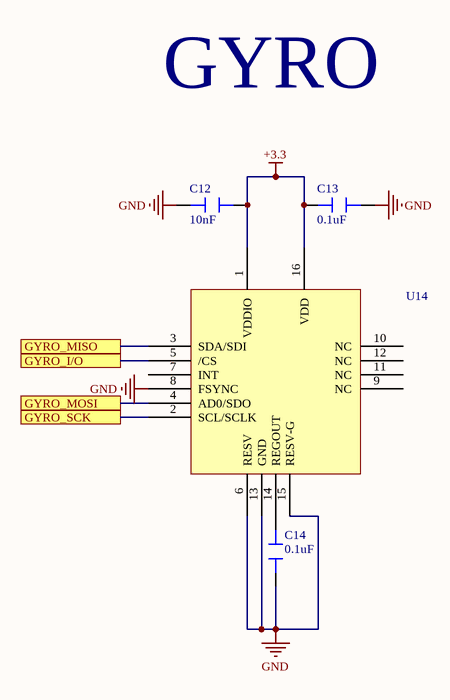
[diagram p3: Gyro.SchDoc]

### Parts
C12  10nF  [CAPACITOR 0805]
C13  0.1uF  [CAPACITOR 0805]
C14  0.1uF  [CAPACITOR 0805]
U14  Gyroscope  [GYROSCOPE]  (value not drawn)

### Ports
GYRO_I/O, GYRO_MISO, GYRO_MOSI, GYRO_SCK

### Nets
+3.3: C12.2 C13.1 U14.1(VDDIO) U14.16(VDD)
GND: C12.1 C13.2 C14.1 U14.6(RESV) U14.8(FSYNC) U14.13(GND) U14.15(RESV-G)
GYRO_I/O: U14.5(/CS) ; port GYRO_I/O
GYRO_MISO: U14.3(SDA/SDI) ; port GYRO_MISO
GYRO_MOSI: U14.4(AD0/SDO) ; port GYRO_MOSI
GYRO_SCK: U14.2(SCL/SCLK) ; port GYRO_SCK
NetC14_2: C14.2 U14.14(REGOUT)

Not connected (* = marked no-connect by the designer): U14 7(INT) 9(NC) 10(NC) 11(NC) 12(NC)

### Notes on the sheet
- GYRO

### Library data of the parts
C12 = Capacitor  10nF 0805: Multilayer Ceramic Capacitors MLCC - SMD/SMT .01uF 50volts 10%; Manufacturer: Vishay Vitramon; Manufacturer Part Number: VJ0805Y103KXAAC; Voltage Rating: 50V; Dielectric: X7R; Supplier 1: Mouser; Stock 1: 543640; Pricing 1: 1=0.26, 10=0.202, 50=0.202, 100=0.09, 500=0.074, 1000=0.051, 3000=0.042, 6000=0.038, 9000=0.033, 10000=0.033, 24000=0.03 (USD); Mount: Surface Mount; Case/Package: 0805; Case Code (Imperial): 0805; Case Code (Metric): 2012; Contact Plating: Tin,Matte; Min Operating Temperature: -55°C; Max Operating Temperature: 125°C; Capacitance: 10nF; Tolerance: 10%; Packaging: Tape and Reel; Voltage Rating (DC): 50V; Package Quantity: 1; Termination: SMD/SMT; Length: 2mm; Height: 1.45mm; Width: 1.25mm; Thickness: 0.057inch; Depth: 1.25mm; Radiation Hardening: No; REACH SVHC: Unknown; Lead Free: Lead Free; ComponentLink1URL: http://www.vishay.com/docs/45051/vjvitramonpackaging.pdf?src-supplier=Digi-Key; ComponentLink1Description: http://www.vishay.com/docs/45051/vjvitramonpackaging.pdf?src-supplier=Digi-Key; ComponentLink2URL: http://www.farnell.com/datasheets/2049140.pdf?src-supplier=Element14; ComponentLink2Description: http://www.farnell.com/datasheets/2049140.pdf?src-supplier=Element14; Category: Multilayer Ceramic Capacitors MLCC - SMD/SMT
C13 C14 = Capacitor  0.1uF 0805: as C2 on sheet Fonte; Supplier 1: Mouser; Stock 1: 207342; Pricing 1: 1=0.2, 10=0.2, 50=0.162, 100=0.108, 500=0.095, 1000=0.084, 3000=0.072, 6000=0.069, 9000=0.065, 10000=0.065 (USD); Mount: Surface Mount; Case/Package: 0805; Weight: 0.000194oz; Case Code (Metric): 2012; Case Code (Imperial): 0805; Min Operating Temperature: -55°C; Max Operating Temperature: 125°C; Tolerance: 10%; Package Quantity: 1; Packaging: Tape and Reel; Voltage Rating (DC): 50V; Termination: SMD/SMT; Voltage: 50V; Length: 2mm; Height: 1.45mm; Width: 0.049inch; Thickness: 0.057inch; Depth: 1.25mm; Radiation Hardening: No; REACH SVHC: Unknown; Lead Free: Lead Free; ComponentLink1URL: http://www.mouser.com/ds/2/427/vjcommercialseries-222796.pdf?src-supplier=Mouser; ComponentLink1Description: http://www.mouser.com/ds/2/427/vjcommercialseries-222796.pdf?src-supplier=Mouser; ComponentLink2URL: http://www.vishay.com/docs/45199/vjcommercialseries.pdf?src-supplier=Digi-Key; ComponentLink2Description: http://www.vishay.com/docs/45199/vjcommercialseries.pdf?src-supplier=Digi-Key; ComponentLink3URL: http://www.vishay.com/docs/45199/vjcommercialseries.pdf?src-supplier=Future+Electronics; ComponentLink3Description: http://www.vishay.com/docs/45199/vjcommercialseries.pdf?src-supplier=Future+Electronics; Supplier Part Number 1: 77-VJ0805Y104KXAAT; Category: Multilayer Ceramic Capacitors MLCC - SMD/SMT
U14 = Gyroscope: MEMS GYROSCOPE 1-AXIS 16QFN; Manufacturer: TDK InvenSense; Output Type: SPI,I2C; Axis: Z; Bandwidth: 5Hz; Operating Supply Current: 2.8mA; Supplier 1: Mouser; Manufacturer Part Number: ISZ-2510; Stock 1: 0; Min Operating Temperature: -40°C; Max Operating Temperature: 85°C; Packaging: Tape and Reel; ComponentLink1URL: https://store.invensense.com/datasheets/invensense/PS-ISZ-2510A-00.pdf?src-supplier=Digi-Key; ComponentLink1Description: https://store.invensense.com/datasheets/invensense/PS-ISZ-2510A-00.pdf?src-supplier=Digi-Key; Supplier Part Number 1: 410-ISZ-2510; Category: Gyroscopes

## Sheet Motor.SchDoc
size A4
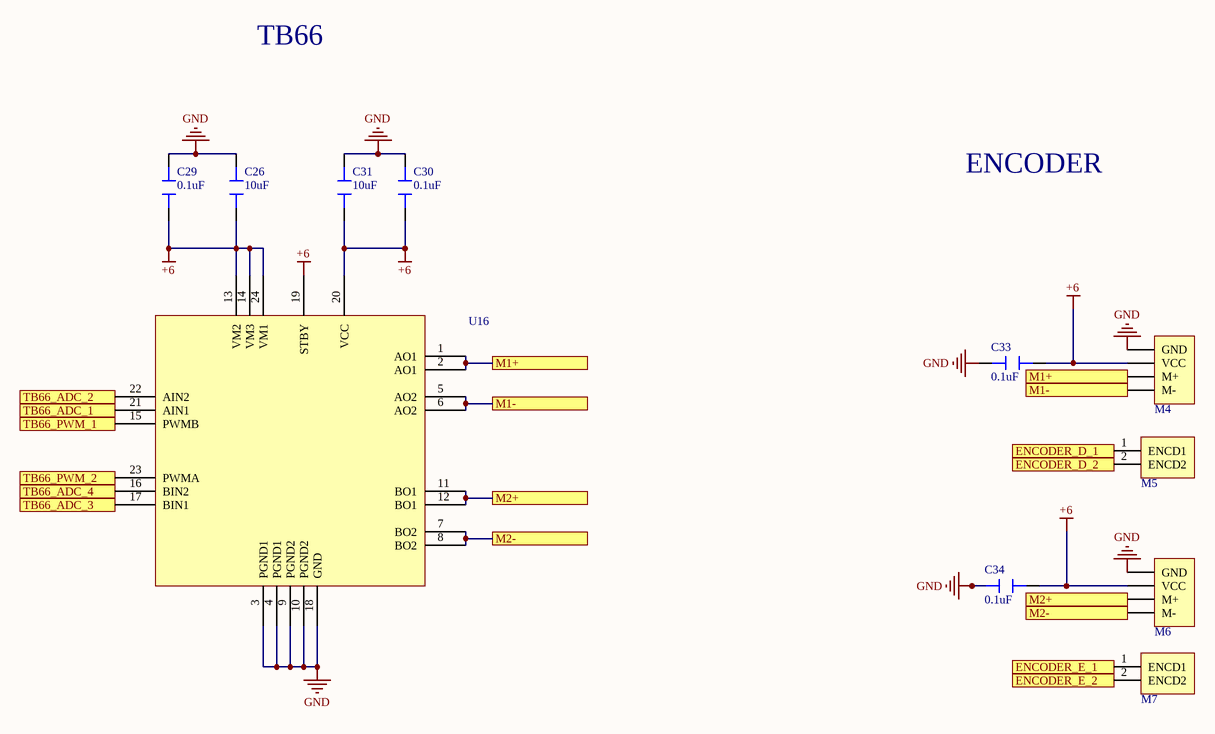
[diagram p4: Motor.SchDoc]

### Parts
C26  10uF  [CAPACITOR 0603]
C29  0.1uF  [CAPACITOR 0805]
C30  0.1uF  [CAPACITOR 0805]
C31  10uF  [CAPACITOR 0603]
C33  0.1uF  [CAPACITOR 0805]
C34  0.1uF  [CAPACITOR 0805]
M4  Headers (1x4)  [HDR1X4]  (value not drawn)
M5  Headers (1x2)ENC  [HDR1X2]  (value not drawn)
M6  Headers (1x4)  [HDR1X4]  (value not drawn)
M7  Headers (1x2)ENC  [HDR1X2]  (value not drawn)
U16  Driver TB6612FNG  [SOP65P760X160-24N]  (value not drawn)

### Ports
ENCODER_D_1, ENCODER_D_2, ENCODER_E_1, ENCODER_E_2, M1+, M1-, M2+, M2-, TB66_ADC_1, TB66_ADC_2, TB66_ADC_3, TB66_ADC_4, TB66_PWM_1, TB66_PWM_2

### Nets
+6: C26.1 C29.1 C30.1 C31.1 C33.1 C34.2 M4.2(VCC) M6.2(VCC) U16.13(VM2) U16.14(VM3) U16.19(STBY) U16.20(VCC) U16.24(VM1)
GND: C26.2 C29.2 C30.2 C31.2 C33.2 C34.1 M4.1(GND) M6.1(GND) U16.3(PGND1) U16.4(PGND1) U16.9(PGND2) U16.10(PGND2) U16.18(GND)
ENCODER_D_1: M5.1(ENCD1) ; port ENCODER_D_1
ENCODER_D_2: M5.2(ENCD2) ; port ENCODER_D_2
ENCODER_E_1: M7.1(ENCD1) ; port ENCODER_E_1
ENCODER_E_2: M7.2(ENCD2) ; port ENCODER_E_2
M1+: M4.3(M+) U16.1(AO1) U16.2(AO1) ; port M1+
M1-: M4.4(M-) U16.5(AO2) U16.6(AO2) ; port M1-
M2+: M6.3(M+) U16.11(BO1) U16.12(BO1) ; port M2+
M2-: M6.4(M-) U16.7(BO2) U16.8(BO2) ; port M2-
TB66_ADC_1: U16.21(AIN1) ; port TB66_ADC_1
TB66_ADC_2: U16.22(AIN2) ; port TB66_ADC_2
TB66_ADC_3: U16.17(BIN1) ; port TB66_ADC_3
TB66_ADC_4: U16.16(BIN2) ; port TB66_ADC_4
TB66_PWM_1: U16.15(PWMB) ; port TB66_PWM_1
TB66_PWM_2: U16.23(PWMA) ; port TB66_PWM_2

### Notes on the sheet
- TB66
- ENCODER

### Library data of the parts
C26 C31 = Capacitor 10uF 0603: Capacitores de cerâmica multicamada MLCC - SMD/SMT 0603 16Vdc 10uF X6S 20%; Manufacturer: Murata; Manufacturer Part Number: GRT188C81C106ME13D; Voltage Rating: 16V; Voltage Rating (DC): 35V; Dielectric: X5R; Supplier 1: Mouser; Stock 1: 1580; Pricing 1: 10000=0.127 (USD); Mount: Surface Mount; Case/Package: 0603; Case Code (Metric): 1608; Case Code (Imperial): 0603; Min Operating Temperature: -55°C; Max Operating Temperature: 105°C; Packaging: Tape and Reel; Capacitance: 10uF; Tolerance: 20%; Length: 0.063inch; Width: 0.031inch; Thickness: 0.035inch; Ratings: AEC-Q200; ComponentLink1Description: Link Mouser; ComponentLink1URL: https://br.mouser.com/ProductDetail/Murata-Electronics/GRT188C81C106ME13D?qs=drgMNd%252bkGPNZ2BDWwi8nsA%3D%3D; Supplier 2: Mouser; Stock 2: 205123; Pricing 2: 1=0.45, 10=0.315, 100=0.188, 500=0.141, 1000=0.119, 4000=0.093, 8000=0.087, 12000=0.084, 24000=0.076 (USD); ComponentLink2URL: http://search.murata.co.jp/Ceramy/image/img/A01X/G101/ENG/GRM188R6YA106MA73-01.pdf?src-supplier=Digi-Key; ComponentLink2Description: http://search.murata.co.jp/Ceramy/image/img/A01X/G101/ENG/GRM188R6YA106MA73-01.pdf?src-supplier=Digi-Key; ComponentLink3URL: http://search.murata.co.jp/Ceramy/image/img/A01X/G101/ENG/GRM188R6YA106MA73-01.pdf?src-supplier=Mouser; ComponentLink3Description: http://search.murata.co.jp/Ceramy/image/img/A01X/G101/ENG/GRM188R6YA106MA73-01.pdf?src-supplier=Mouser; ComponentLink4URL: https://www.murata.com/~/media/webrenewal/support/library/catalog/products/capacitor/mlcc/c02e.ashx?la=en-us&src-supplier=Digi-Key; ComponentLink4Description: https://www.murata.com/~/media/webrenewal/support/library/catalog/products/capacitor/mlcc/c02e.ashx?la=en-us&src-supplier=Digi-Key; ComponentLink5URL: http://search.murata.co.jp/Ceramy/image/img/A01X/G101/ENG/GRM188R6YA106MA73-01.pdf?src-supplier=Future+Electronics; ComponentLink5Description: http://search.murata.co.jp/Ceramy/image/img/A01X/G101/ENG/GRM188R6YA106MA73-01.pdf?src-supplier=Future+Electronics; ComponentLink6URL: http://search.murata.co.jp/Ceramy/image/img/A01X/G101/ENG/GRM188R6YA106MA73-01.pdf?src-supplier=TTI; ComponentLink6Description: http://search.murata.co.jp/Ceramy/image/img/A01X/G101/ENG/GRM188R6YA106MA73-01.pdf?src-supplier=TTI; Category: Multilayer Ceramic Capacitors MLCC - SMD/SMT; Supplier Part Number 2: 81-GRM188R6YA106MA3D
C29 C30 C33 C34 = Capacitor  0.1uF 0805: as C2 on sheet Fonte; Supplier 1: Mouser; Stock 1: 207342; Pricing 1: 1=0.2, 10=0.2, 50=0.162, 100=0.108, 500=0.095, 1000=0.084, 3000=0.072, 6000=0.069, 9000=0.065, 10000=0.065 (USD); Mount: Surface Mount; Case/Package: 0805; Weight: 0.000194oz; Case Code (Metric): 2012; Case Code (Imperial): 0805; Min Operating Temperature: -55°C; Max Operating Temperature: 125°C; Tolerance: 10%; Package Quantity: 1; Packaging: Tape and Reel; Voltage Rating (DC): 50V; Termination: SMD/SMT; Voltage: 50V; Length: 2mm; Height: 1.45mm; Width: 0.049inch; Thickness: 0.057inch; Depth: 1.25mm; Radiation Hardening: No; REACH SVHC: Unknown; Lead Free: Lead Free; ComponentLink1URL: http://www.mouser.com/ds/2/427/vjcommercialseries-222796.pdf?src-supplier=Mouser; ComponentLink1Description: http://www.mouser.com/ds/2/427/vjcommercialseries-222796.pdf?src-supplier=Mouser; ComponentLink2URL: http://www.vishay.com/docs/45199/vjcommercialseries.pdf?src-supplier=Digi-Key; ComponentLink2Description: http://www.vishay.com/docs/45199/vjcommercialseries.pdf?src-supplier=Digi-Key; ComponentLink3URL: http://www.vishay.com/docs/45199/vjcommercialseries.pdf?src-supplier=Future+Electronics; ComponentLink3Description: http://www.vishay.com/docs/45199/vjcommercialseries.pdf?src-supplier=Future+Electronics; Supplier Part Number 1: 77-VJ0805Y104KXAAT; Category: Multilayer Ceramic Capacitors MLCC - SMD/SMT
M4 M6 = Headers (1x4): Header, 4-Pin; LatestRevisionDate: 17-Jul-2002; LatestRevisionNote: Re-released for DXP Platform.; Publisher: Altium Limited
M5 M7 = Headers (1x2)ENC: Headers & Wire Housings HDR STRT SINGLE 2P; Manufacturer: Molex; Manufacturer Part Number: 90136-1202; Number of Poles: 2; Current Rating: 3A; Voltage Rating (AC): 350V; Contact Resistance: 20mR; Max Voltage Rating (DC): 350.35kV; Insulation Resistance: 5GR; Gender: Male; Pitch: 2.54mm; Glow Wire Compliant: Non-compliant; Supplier 1: Mouser; Stock 1: 2623; Pricing 1: 1=1.07, 10=0.89, 50=0.89, 100=0.776, 500=0.677, 1000=0.613, 2500=0.536, 10000=0.492, 25000=0.479, 50000=0.467 (USD); Mount: Through Hole; Contact Plating: Gold; Contact Material: Brass,Copper Alloy; Color: Black; Housing Color: Black; Housing Material: Polyester; Min Operating Temperature: -55°C; Max Operating Temperature: 125°C; Number of Rows: 1; Packaging: Tray; Package Quantity: 3040; Voltage Rating: 350V; Number of Positions: 2; Termination: Through Hole; Number of Circuits: 2; Number of Contacts: 2; Working Voltage: 350V; Orientation: Vertical; Voltage Rating (DC): 350V; Lead Pitch: 2.54mm; Radiation Hardening: No; REACH SVHC: Unknown; Lead Free: Lead Free; Flammability Rating: UL94 V-0; ComponentLink1URL: http://www.molex.com/webdocs/datasheets/pdf/en-us/0901361202_PCB_HEADERS.pdf?src-supplier=Avnet+Europe; ComponentLink1Description: http://www.molex.com/webdocs/datasheets/pdf/en-us/0901361202_PCB_HEADERS.pdf?src-supplier=Avnet+Europe; ComponentLink2URL: http://www.mouser.com/ds/2/276/0901361202_PCB_HEADERS-176812.pdf?src-supplier=Mouser; ComponentLink2Description: http://www.mouser.com/ds/2/276/0901361202_PCB_HEADERS-176812.pdf?src-supplier=Mouser; ComponentLink3URL: http://www.molex.com/webdocs/datasheets/pdf/en-us/0901361202_PCB_HEADERS.pdf?src-supplier=Avnet; ComponentLink3Description: http://www.molex.com/webdocs/datasheets/pdf/en-us/0901361202_PCB_HEADERS.pdf?src-supplier=Avnet; ComponentLink4URL: https://www.distrelec.biz/Web/Downloads/_d/wg/cgrid_III_90136_eng_dwg.pdf?mime=application%2Fpdf&src-supplier=Distrelec; ComponentLink4Description: https://www.distrelec.biz/Web/Downloads/_d/wg/cgrid_III_90136_eng_dwg.pdf?mime=application%2Fpdf&src-supplier=Distrelec; ComponentLink5URL: http://uk.rs-online.com/webdocs/1362/0900766b81362c51.pdf?src-supplier=RSComponents; ComponentLink5Description: http://uk.rs-online.com/webdocs/1362/0900766b81362c51.pdf?src-supplier=RSComponents; ComponentLink6URL: http://www.onlinecomponents.com/productFiles/mf-MOL/248400901361202_pcb_headers.pdf?src-supplier=Onlinecomponents.com; ComponentLink6Description: http://www.onlinecomponents.com/productFiles/mf-MOL/248400901361202_pcb_headers.pdf?src-supplier=Onlinecomponents.com; Supplier Part Number 1: 538-90136-1202; Category: Headers & Wire Housings
U16 = Driver TB6612FNG: DC Motor Driver 3V 24-Pin SSOP T/R; Manufacturer: Toshiba; Manufacturer Part Number: TB6612FNG,C,8,EL; Number of Outputs: 2; Min Supply Voltage: 2.7V; Max Supply Voltage: 5.5V; Output Current: 1A; Logic Function: AND; Interface: Parallel; Supplier 1: Mouser; Stock 1: 0; Pricing 1: 1=1.58, 10=1.53, 50=1.53, 100=1.22, 500=1.09, 1000=0.985, 2000=0.91, 10000=0.825 (USD); Mount: Surface Mount; Case/Package: SSOP; Number of Pins: 24; Min Operating Temperature: -20°C; Max Operating Temperature: 85°C; Packaging: Tape and Reel; Package Quantity: 1; Operating Supply Voltage: 3V; ComponentLink1URL: http://www.mouser.com/ds/2/408/TB6612FNG_datasheet_en_20141001-736972.pdf?src-supplier=Mouser; ComponentLink1Description: http://www.mouser.com/ds/2/408/TB6612FNG_datasheet_en_20141001-736972.pdf?src-supplier=Mouser; Supplier Part Number 1: 757-TB6612FNGC8EL; Category: Motor / Motion / Ignition Controllers & Drivers